# EAGLE board LiPoLoader (EAGLE 7.3.0), part 1 of 2
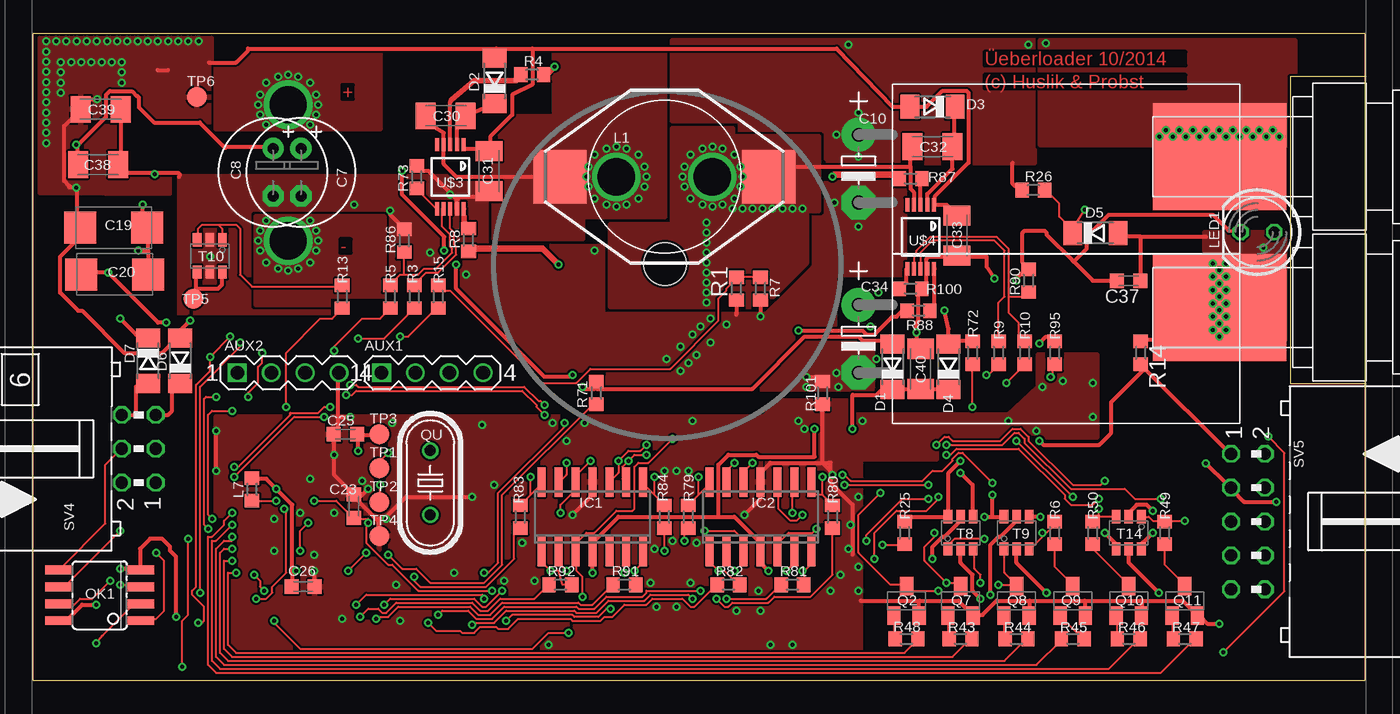
[diagram p2: board, top side]
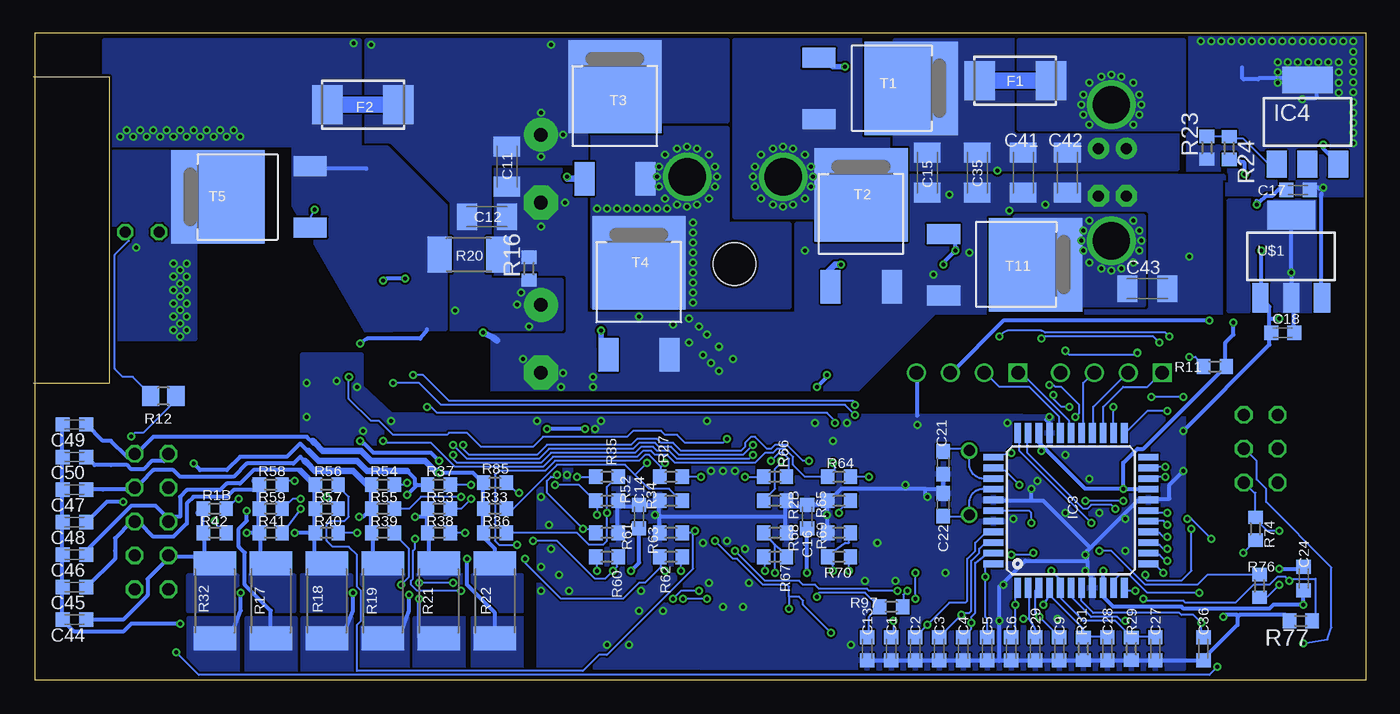
[diagram p3: board, bottom side, seen from below]

Size 99.9 x 48.5 mm. Coordinates in mm from the lower left corner, seen from the top.
Outline: 99.9,45.25 94.2,45.25 94.2,22.25 99.9,22.25
Copper layers (1*16): Top 0.035mm / dielectric 1.5mm / Bottom 0.035mm
Design rules "Fischer-LP *": minimum track width 0.15mm, minimum drill 0.3mm, track to track 0.15mm, track to pad 0.15mm, pad to pad 0.15mm, via to via 0.15mm, smd to smd 0mil, copper to edge 0.2mm, drill to drill 0.3mm, minimum pad ring 0.2mm, minimum via ring 0.15mm, stop-mask expansion 0.1mm, vias tented up to drill 0.5mm, thermal gap 0.15mm
Net classes: 1 Hi-Power: width 0.3 mm; 2 Lo-Power: width 0.3 mm; 3 Iso-bus: clearance 0.6 mm to class 0, clearance 0.6 mm to class 1, clearance 0.6 mm to class 2
Holes 3.2 mm at 47.36,31.21
tRestrict: 15 lines
bRestrict: 8 lines
vRestrict: area 22.5,27.4 to 30.3,28.6

## Footprints (pad centres in the part's own frame; a part is rotated, then mirrored left to right if it is on the bottom)
MA04-1 = drill 1.016 square: 1 -3.81,0 | drill 1.016 round: 2 -1.27,0; 3 1.27,0; 4 3.81,0
C0603K = smd 1.05 x 1.08: 1 -0.875,0; 2 0.875,0
E3,5-8 = drill 0.813 pad 1.6 round: + -1.778,0 | drill 0.813 pad 1.6 octagon: - 1.778,0
E5-13-L = drill 1.016 pad 2.54 round: + -2.54,0 | drill 1.016 pad 2.54 octagon: - 2.54,0
C1206K = smd 1.5 x 2: 1 -1.5,0; 2 1.5,0
SMC_C = smd 2.4 x 2.4: + -2.5,0; - 2.5,0
C0603 = smd 1.1 x 1: 1 -0.85,0; 2 0.85,0
SOLPAD3MM = drill 2.8 round: P$1 0,0
SOD80C = smd 1.4 x 1.8: A 1.7,0; C -1.7,0
WSC2515 = smd 2.29 x 2.92: 1 -2.675,0; 2 2.675,0
SO14 = smd 0.6 x 2.2: 1 -3.81,-2.6; 2 -2.54,-2.6; 3 -1.27,-2.6; 4 0,-2.6; 5 1.27,-2.6; 6 2.54,-2.6; 7 3.81,-2.6; 8 3.81,2.6; 9 2.54,2.6; 10 1.27,2.6; 11 0,2.6; 12 -1.27,2.6; 13 -2.54,2.6; 14 -3.81,2.6
TQFP44 = smd 1.5 x 0.5: 1 -5.8,4; 2 -5.8,3.2; 3 -5.8,2.4; 4 -5.8,1.6; 5 -5.8,0.8; 6 -5.8,0; 7 -5.8,-0.8; 8 -5.8,-1.6; 9 -5.8,-2.4; 10 -5.8,-3.2; 11 -5.8,-4; 23 5.8,-4; 24 5.8,-3.2; 25 5.8,-2.4; 26 5.8,-1.6; 27 5.8,-0.8; 28 5.8,0; 29 5.8,0.8; 30 5.8,1.6; 31 5.8,2.4; 32 5.8,3.2; 33 5.8,4 | smd 0.5 x 1.5: 12 -4,-5.8; 13 -3.2,-5.8; 14 -2.4,-5.8; 15 -1.6,-5.8; 16 -0.8,-5.8; 17 0,-5.8; 18 0.8,-5.8; 19 1.6,-5.8; 20 2.4,-5.8; 21 3.2,-5.8; 22 4,-5.8; 34 4,5.8; 35 3.2,5.8; 36 2.4,5.8; 37 1.6,5.8; 38 0.8,5.8; 39 0,5.8; 40 -0.8,5.8; 41 -1.6,5.8; 42 -2.4,5.8; 43 -3.2,5.8; 44 -4,5.8
SOT223 = smd 1.5 x 2: 1 -2.3,-3.15; 2 0,-3.15; 3 2.3,-3.15 | smd 3.8 x 2: 4 0,3.15
D333 = smd 4 x 4: 1 -7.82,0; 2 7.82,0
R0603 = smd 1 x 1.1: 1 -0.85,0; 2 0.85,0
LED5MM = drill 0.813 octagon: A -1.27,0; K 1.27,0
SOIC08 = smd 0.66 x 2.032: 1 -1.905,-3.073; 2 -0.635,-3.073; 3 0.635,-3.073; 4 1.905,-3.073; 5 1.905,3.073; 6 0.635,3.073; 7 -0.635,3.073; 8 -1.905,3.073
SOT23-BEC = smd 1 x 1.4: B -0.95,-1.1; C 0,1.1; E 0.95,-1.1
HC49U-V = drill 0.813 round: 1 -2.413,0; 2 2.413,0
R0805 = smd 1.3 x 1.5: 1 -0.95,0; 2 0.95,0
R2512 = smd 1.8 x 3.2: 1 -2.8,0; 2 2.8,0
R2010 = smd 1.8 x 2.7: 1 -2.2,0; 2 2.2,0
ML6L = drill 0.914 octagon: 1 -2.54,-1.27; 2 -2.54,1.27; 3 0,-1.27; 4 0,1.27; 5 2.54,-1.27; 6 2.54,1.27
ML10L = drill 0.914 octagon: 1 -5.08,-1.27; 2 -5.08,1.27; 3 -2.54,-1.27; 4 -2.54,1.27; 5 0,-1.27; 6 0,1.27; 7 2.54,-1.27; 8 2.54,1.27; 9 5.08,-1.27; 10 5.08,1.27
DPAK = smd 1.5 x 2.5: 1 -2.3,-6.9; 3 2.3,-6.9 | smd 7 x 7: 4 0,0
SUPERSOT-6 = smd 0.65 x 1: P$1 -0.95,-1.2; P$2 0,-1.2; P$3 0.95,-1.2; P$4 0.95,1.2; P$5 0,1.2; P$6 -0.95,1.2
TP15R = smd 1.5 x 1.5: TP 0,0
SOT223' = smd 1.219 x 2.235: LEFT -2.311,-3.099; MID 0,-3.099; RIGHT 2.311,-3.099 | smd 3.6 x 2.2: TAP 0,3.099
MSOP10W = smd 0.3 x 1: 1 -1,-2.4; 2 -0.5,-2.4; 3 0,-2.4; 4 0.5,-2.4; 5 1,-2.4; 6 1,2.4; 7 0.5,2.4; 8 0,2.4; 9 -0.5,2.4; 10 -1,2.4
BUCHSE4MML = smd 10 x 8: P$1 5,0

## Placement (x,y rotation side)
AUX1  aux  [MA04-1]  29.9,23.05 0 top
AUX2  encoder  [MA04-1]  19.1,23.05 0 top
C1  100n  [C0603K]  35.6,2.35 90 bottom
C2  100n  [C0603K]  33.8,2.35 90 bottom
C3  100n  [C0603K]  32,2.35 90 bottom
C4  100n  [C0603K]  30.2,2.35 90 bottom
C5  100n  [C0603K]  28.4,2.35 90 bottom
C6  100n  [C0603K]  26.6,2.35 90 bottom
C7  330µF / 25V  [E3,5-8]  20.06,38.09 270 top
C8  330µF / 25V  [E3,5-8]  17.97,38.09 270 top
C9  100n  [C0603K]  23,2.35 90 bottom
C10  1000µF/35V  [E5-13-L]  61.85,38.35 270 top
C11  1u  [C1206K]  64.4,38.5 90 bottom
C12  10µF  [C1206K]  65.9,34.75 0 bottom
C13  100n  [C0603K]  37.4,2.35 90 bottom
C14  100n  [C0603K]  54.5,12.25 270 bottom
C15  1u  [C1206K]  32.9,38.05 90 bottom
C16  100n  [C0603K]  41.9,12.25 270 bottom
C17  100n  [C0603K]  5.1,36.75 0 bottom
C18  100n  [C0603K]  6.25,26.05 0 bottom
C19  100u Tan  [SMC_C]  6.03,33.93 0 top
C20  100u Tan  [SMC_C]  6.1,30.42 0 top
C21  10p  [C0603]  31.7,16.3 90 bottom
C22  10p  [C0603]  31.7,13.15 270 bottom
C23  100n  [C0603K]  24.03,13.04 270 top
C24  100n  [C0603K]  4.68,7.61 270 bottom
C25  100n  [C0603K]  23.39,18.43 0 top
C26  100n  [C0603K]  20.22,7.01 180 top
C27  100n  [C0603K]  15.8,2.35 90 bottom
C28  100n  [C0603K]  19.4,2.35 90 bottom
C29  100n  [C0603K]  24.8,2.35 90 bottom
C30  1u  [C1206K]  30.91,42.31 0 top
C31  1u  [C1206K]  34.16,38.16 90 top
C32  1u  [C1206K]  67.4,40 0 top
C33  1u  [C1206K]  69.23,33.33 90 top
C34  1000µF/35V  [E5-13-L]  61.85,25.6 270 top
C35  10µF  [C1206K]  29.15,38.05 270 bottom
C36  100n  [C0603K]  12.2,2.35 90 bottom
C37  100n  [C0603K]  82.1,29.95 180 top
C38  1u  [C1206K]  4.85,38.65 180 top
C39  1u  [C1206K]  5.05,42.8 180 top
C40  1u  [C1206K]  66.5,23.35 270 top
C41  10µF  [C1206K]  25.7,38.05 270 bottom
C42  10µF  [C1206K]  22.4,38.05 270 bottom
C43  10µF  [C1206K]  16.4,29.35 0 bottom
C44  100n  [C0603K]  96.83,4.54 180 bottom
C45  100n  [C0603K]  96.83,6.98 180 bottom
C46  100n  [C0603K]  96.83,9.42 180 bottom
C47  100n  [C0603K]  96.83,14.29 180 bottom
C48  100n  [C0603K]  96.83,11.86 180 bottom
C49  100n  [C0603K]  96.83,19.17 180 bottom
C50  100n  [C0603K]  96.83,16.73 180 bottom
COIL1  SOLPAD3MM  [SOLPAD3MM]  43.7,37.75 0 top
COIL2  SOLPAD3MM  [SOLPAD3MM]  50.9,37.75 0 top
D1  LL43-GS08  [SOD80C]  64.4,23.5 90 top
D2  LL43-GS08  [SOD80C]  34.57,44.93 90 top
D3  LL43-GS08  [SOD80C]  67.4,43 180 top
D4  LL43-GS08  [SOD80C]  68.6,23.5 90 top
D5  15V BZT55C15  [SOD80C]  79.61,33.53 0 top
D6  LL43-GS08  [SOD80C]  11,23.95 90 top
D7  LL43-GS08  [SOD80C]  8.6,23.95 270 top
F1  Fuse 10A  [WSC2515]  26.3,44.95 0 bottom
F2  Fuse 10A  [WSC2515]  75.2,43.15 180 bottom
IC1  LM224D  [SO14]  41.9,12.25 0 top
IC2  LM224D  [SO14]  54.5,12.25 0 top
IC3  AVR_XMEGA_A4_44A  [TQFP44]  22.12,12.72 90 bottom
IC4  LM317MSTT3  [SOT223]  4.4,41.85 0 bottom
L1  COILCRAFT_D333  [D333]  47.3,37.75 0 top
L7  27nH  [R0603]  16.39,14.31 90 top
LED1  [LED5MM]  91.75,33.6 180 top
OK1  ILD217  [SOIC08]  4.98,6.37 90 top
Q2  BC817-25SMD  [SOT23-BEC]  65.45,5.95 0 top
Q7  BC817-25SMD  [SOT23-BEC]  69.5,5.95 0 top
Q8  BC817-25SMD  [SOT23-BEC]  73.7,5.95 0 top
Q9  BC817-25SMD  [SOT23-BEC]  77.9,5.95 0 top
Q10  BC817-25SMD  [SOT23-BEC]  82.1,5.95 0 top
Q11  BC817-25SMD  [SOT23-BEC]  86.3,5.95 0 top
QU  16MHz  [HC49U-V]  29.75,14.8 90 top
R1  2k2  [R0603]  52.7,29.35 90 top
R1B  43k - 0.1%  [R0603]  86.3,12.85 0 bottom
R2B  20k - 0.1%  [R0603]  44.3,13.45 180 bottom
R3  0R  [R0603]  28.55,28.75 90 top
R4  10  [R0603]  37.39,45.41 180 top
R5  0R  [R0603]  26.75,28.75 90 top
R6  10k  [R0603]  76.55,11.05 90 top
R7  NB12K00103JBB  [R0603]  54.5,29.35 90 top
R8  10  [R0603]  32.62,33.02 90 top
R9  0R  [R0603]  72.35,24.55 270 top
R10  0R  [R0603]  74.3,24.55 270 top
R11  2k2  [R0603]  11.33,23.52 0 bottom
R12  330  [R0805]  90.15,21.3 180 bottom
R13  0R  [R0603]  23.15,28.75 90 top
R14  2k2  [R0603]  83,24.55 270 top
R15  0R  [R0603]  30.35,28.75 270 top
R16  10k  [R0603]  62.75,30.85 90 bottom
R17  10  [R2512]  82.1,5.95 270 bottom
R18  10  [R2512]  77.9,5.95 270 bottom
R19  10  [R2512]  73.7,5.95 270 bottom
R20  0.005R  [R2010]  67.25,31.9 180 bottom
R21  10  [R2512]  69.5,5.95 270 bottom
R22  10  [R2512]  65.3,5.95 270 bottom
R23  470  [R0603]  11.94,39.91 90 bottom
R24  3300  [R0603]  10.26,39.9 270 bottom
R25  43k - 0.1%  [R0603]  65.3,11.05 270 top
R26  100k  [R0603]  74.96,36.75 0 top
R27  20k - 0.1%  [R0603]  52.1,15.25 180 bottom
R29  10k - 0.1%  [R0603]  17.6,2.35 270 bottom
R31  10k - 0.1%  [R0603]  21.2,2.35 270 bottom
R32  10  [R2512]  86.3,5.95 270 bottom
R33  43k - 0.1%  [R0603]  65.3,12.85 0 bottom
R34  20k - 0.1%  [R0603]  52.1,13.45 0 bottom
R35  20k - 0.1%  [R0603]  56.9,15.25 0 bottom
R36  43k - 0.1%  [R0603]  65.3,11.05 0 bottom
R37  43k - 0.1%  [R0603]  69.5,14.65 0 bottom
R38  10k  [R0603]  69.5,11.05 180 bottom
R39  10k  [R0603]  73.7,11.05 180 bottom
R40  10k  [R0603]  77.9,11.05 180 bottom
R41  10k  [R0603]  82.1,11.05 180 bottom
R42  10k  [R0603]  86.3,11.05 180 bottom
R43  4k7  [R0603]  69.5,3.1 180 top
R44  4k7  [R0603]  73.7,3.1 180 top
R45  4k7  [R0603]  77.9,3.1 0 top
R46  4k7  [R0603]  82.1,3.1 180 top
R47  4k7  [R0603]  86.3,3.1 180 top
R48  4k7  [R0603]  65.45,3.1 180 top
R49  10k  [R0603]  84.8,11.05 90 top
R50  10k  [R0603]  79.4,11.05 90 top
R52  20k - 0.1%  [R0603]  56.9,13.45 180 bottom
R53  43k - 0.1%  [R0603]  69.5,12.85 0 bottom
R54  43k - 0.1%  [R0603]  73.7,14.65 0 bottom
R55  43k - 0.1%  [R0603]  73.7,12.85 0 bottom
R56  43k - 0.1%  [R0603]  77.9,14.65 0 bottom
R57  43k - 0.1%  [R0603]  77.9,12.85 0 bottom
R58  43k - 0.1%  [R0603]  82.1,14.65 0 bottom
R59  43k - 0.1%  [R0603]  82.1,12.85 0 bottom
R60  20k - 0.1%  [R0603]  56.9,9.25 0 bottom
R61  20k - 0.1%  [R0603]  56.9,11.05 180 bottom
R62  20k - 0.1%  [R0603]  52.1,9.25 180 bottom
R63  20k - 0.1%  [R0603]  52.1,11.05 0 bottom
R64  20k - 0.1%  [R0603]  39.5,15.25 180 bottom
R65  20k - 0.1%  [R0603]  39.5,13.45 0 bottom
R66  20k - 0.1%  [R0603]  44.3,15.25 0 bottom
R67  10k - 0.1%  [R0603]  44.3,9.25 0 bottom
R68  2k - 0.1%  [R0603]  44.3,11.05 0 bottom
R69  2k - 0.1%  [R0603]  39.5,11.05 180 bottom
R70  36k - 0.1%  [R0603]  39.5,9.25 180 bottom
R71  120k - 0.1%  [R0603]  42.2,21.55 270 top
R72  120k - 0.1%  [R0603]  70.4,24.55 270 top
R73  10k  [R0603]  28.74,37.72 90 top
R74  820  [R0603]  8.3,11.35 270 bottom
R76  820  [R0603]  8,7.06 90 bottom
R77  4k7  [R0603]  4.9,4.45 180 bottom
R79  10k  [R0603]  49.1,12.25 90 top
R80  10k  [R0603]  59.9,12.25 90 top
R81  10k  [R0603]  56.9,7.15 0 top
R82  10k  [R0603]  52.1,7.15 0 top
R83  10k  [R0603]  36.5,12.25 90 top
R84  10k  [R0603]  47.3,12.25 90 top
R85  10k  [R0603]  65.3,14.8 180 bottom
R86  10k  [R0603]  27.8,32.95 90 top
R87  10  [R0603]  65.75,37.6 0 top
R88  10  [R0603]  66.35,27.7 0 top
R90  10k  [R0603]  74.6,29.95 90 top
R91  10k  [R0603]  44.3,7.15 0 top
R92  10k  [R0603]  39.5,7.15 0 top
R95  2k - 0.1%  [R0603]  76.55,24.55 90 top
R97  120k - 0.1%  [R0603]  35.6,5.5 180 bottom
R100  10k  [R0603]  65.75,29.35 0 top
R101  0R  [R0603]  59.15,21.55 90 top
SUPP+  SOLPAD3MM  [SOLPAD3MM]  19.1,43.15 0 top
SUPP-  SOLPAD3MM  [SOLPAD3MM]  19.1,32.95 0 top
SV4  comm  [ML6L]  7.9,17.35 90 top
SV5  [ML10L]  91.04,11.89 270 top
T1  MOSFET-NIRLR8743  [DPAK]  34.11,44.37 270 bottom
T2  MOSFET-NIRLR8743  [DPAK]  37.85,36.4 0 bottom
T3  MOSFET-NIRLR8743  [DPAK]  56.3,44.5 0 bottom
T4  MOSFET-NIRLR8743  [DPAK]  54.5,31.3 0 bottom
T5  MOSFET-NIRLR8743  [DPAK]  86.05,36.25 90 bottom
T8  QS6J1=FDC6312P  [SUPERSOT-6]  69.5,11.05 0 top
T9  QS6J1=FDC6312P  [SUPERSOT-6]  73.7,11.05 0 top
T10  FDC6401N  [SUPERSOT-6]  13.23,31.8 180 top
T11  MOSFET-NIRLR8743  [DPAK]  24.78,31.16 270 bottom
T14  QS6J1=FDC6312P  [SUPERSOT-6]  82.1,11.05 180 top
TP1  TPTP15R  [TP15R]  25.93,15.89 0 top
TP2  TPTP15R  [TP15R]  25.93,13.36 0 top
TP3  TPTP15R  [TP15R]  25.93,18.43 0 top
TP4  TPTP15R  [TP15R]  25.93,10.81 0 top
TP5  TPTP15R  [TP15R]  12,28.59 0 top
TP6  TPTP15R  [TP15R]  12.25,43.73 0 top
U$1  LM1117  [SOT223']  5.62,31.77 0 bottom
U$2  [GEH_FISCHER_AKG55XX100_BODEN]  -0.1,-1.25 0 top
U$3  LM5106  [MSOP10W]  31.25,37.75 180 top
U$4  LM5106  [MSOP10W]  66.5,33.25 180 top
U$5  BUCHSE4MM  [BUCHSE4MML]  83.9,39.25 0 top
U$6  BUCHSE4MM  [BUCHSE4MML]  83.9,27.95 0 top